# EasyEDA Pro project ProProject_Hauptplatine_ESP32.epro, schematic ESP32-LedTreiber_V110
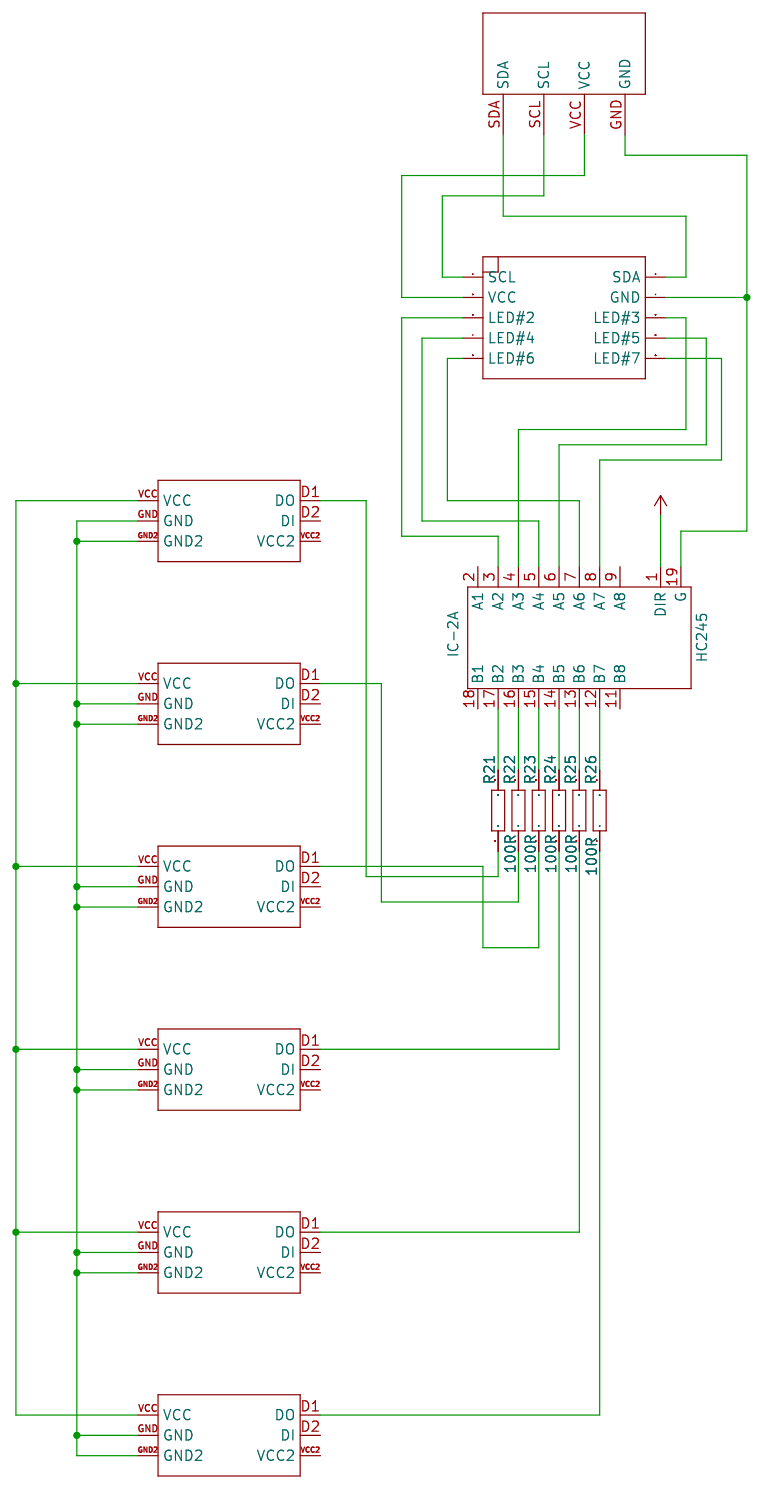
[diagram p9: schematic sheet]

## Parts
IC-2  HC245  (section A)
LED_IN  MLL-32-EXT10
OUT2A  LED-BUS-OUTPUT
OUT3A  LED-BUS-OUTPUT
OUT4A  LED-BUS-OUTPUT
OUT5A  LED-BUS-OUTPUT
OUT6A  LED-BUS-OUTPUT
OUT7A  LED-BUS-OUTPUT
R21  100R
R22  100R
R23  100R
R24  100R
R25  100R
R26  100R
U$7  I2C

## Library data of the parts
IC-2 = 0 ProSaH-74xx_74*245_N
LED_IN = MLL-Dominik-Hardi_MLL-32-EXT10_
OUT2A OUT3A OUT4A OUT5A OUT6A OUT7A = MLL-Dominik-Hardi_LED-BUS-OUTPUT_
R21-R26 = 0 ProSaH-PASSIV_RESISTOR_-1/8W
U$7 = MLL-Dominik-Hardi_I2C_

## Nets
5V: IC-2.1(DIR)
GND: IC-2.19(G) LED_IN.4(GND) OUT2A.GND OUT2A.GND2 OUT3A.GND OUT3A.GND2 OUT4A.GND OUT4A.GND2 OUT5A.GND OUT5A.GND2 OUT6A.GND OUT6A.GND2 OUT7A.GND OUT7A.GND2 U$7.GND
VCC_1: OUT2A.VCC OUT3A.VCC OUT4A.VCC OUT5A.VCC OUT6A.VCC OUT7A.VCC
DO1: OUT2A.D1(DO) R21.1
DO9: OUT6A.D1(DO) R25.1
DO10: OUT5A.D1(DO) R24.1
DO11: OUT4A.D1(DO) R23.1
DO12: OUT3A.D1(DO) R22.1
LB#2: IC-2.3(A2) LED_IN.5(LED#2)
LB#3: IC-2.4(A3) LED_IN.6(LED#3)
LB#4: IC-2.5(A4) LED_IN.7(LED#4)
LB#5: IC-2.6(A5) LED_IN.8(LED#5)
LB#6: IC-2.7(A6) LED_IN.9(LED#6)
LB#7: IC-2.8(A7) LED_IN.10(LED#7)
N_6: OUT7A.D1(DO) R26.1
N_47: IC-2.17(B2) R21.2
N_62: IC-2.16(B3) R22.2
N_76: IC-2.15(B4) R23.2
N_77: IC-2.14(B5) R24.2
N_78: IC-2.13(B6) R25.2
N_79: IC-2.12(B7) R26.2
SCL: LED_IN.1(SCL) U$7.SCL
SDA: LED_IN.3(VCC) U$7.VCC
Net-(LED_IN-2): LED_IN.2(SDA) U$7.SDA

Not connected (* = marked no-connect by the designer): IC-2 2(A1) 9(A8) 11(B8) 18(B1); OUT2A D2(DI) VCC2; OUT3A D2(DI) VCC2; OUT4A D2(DI) VCC2; OUT5A D2(DI) VCC2; OUT6A D2(DI) VCC2; OUT7A D2(DI) VCC2
